# EasyEDA schematic SCH_TDA-Audio-Amplifier_2024-02-14.json
TITLE: TDA2050; REV: 1.0; Date: 2024-01-14; Sheet: 1/1; Drawn By: Vikas Ganesh; Company: Your Company
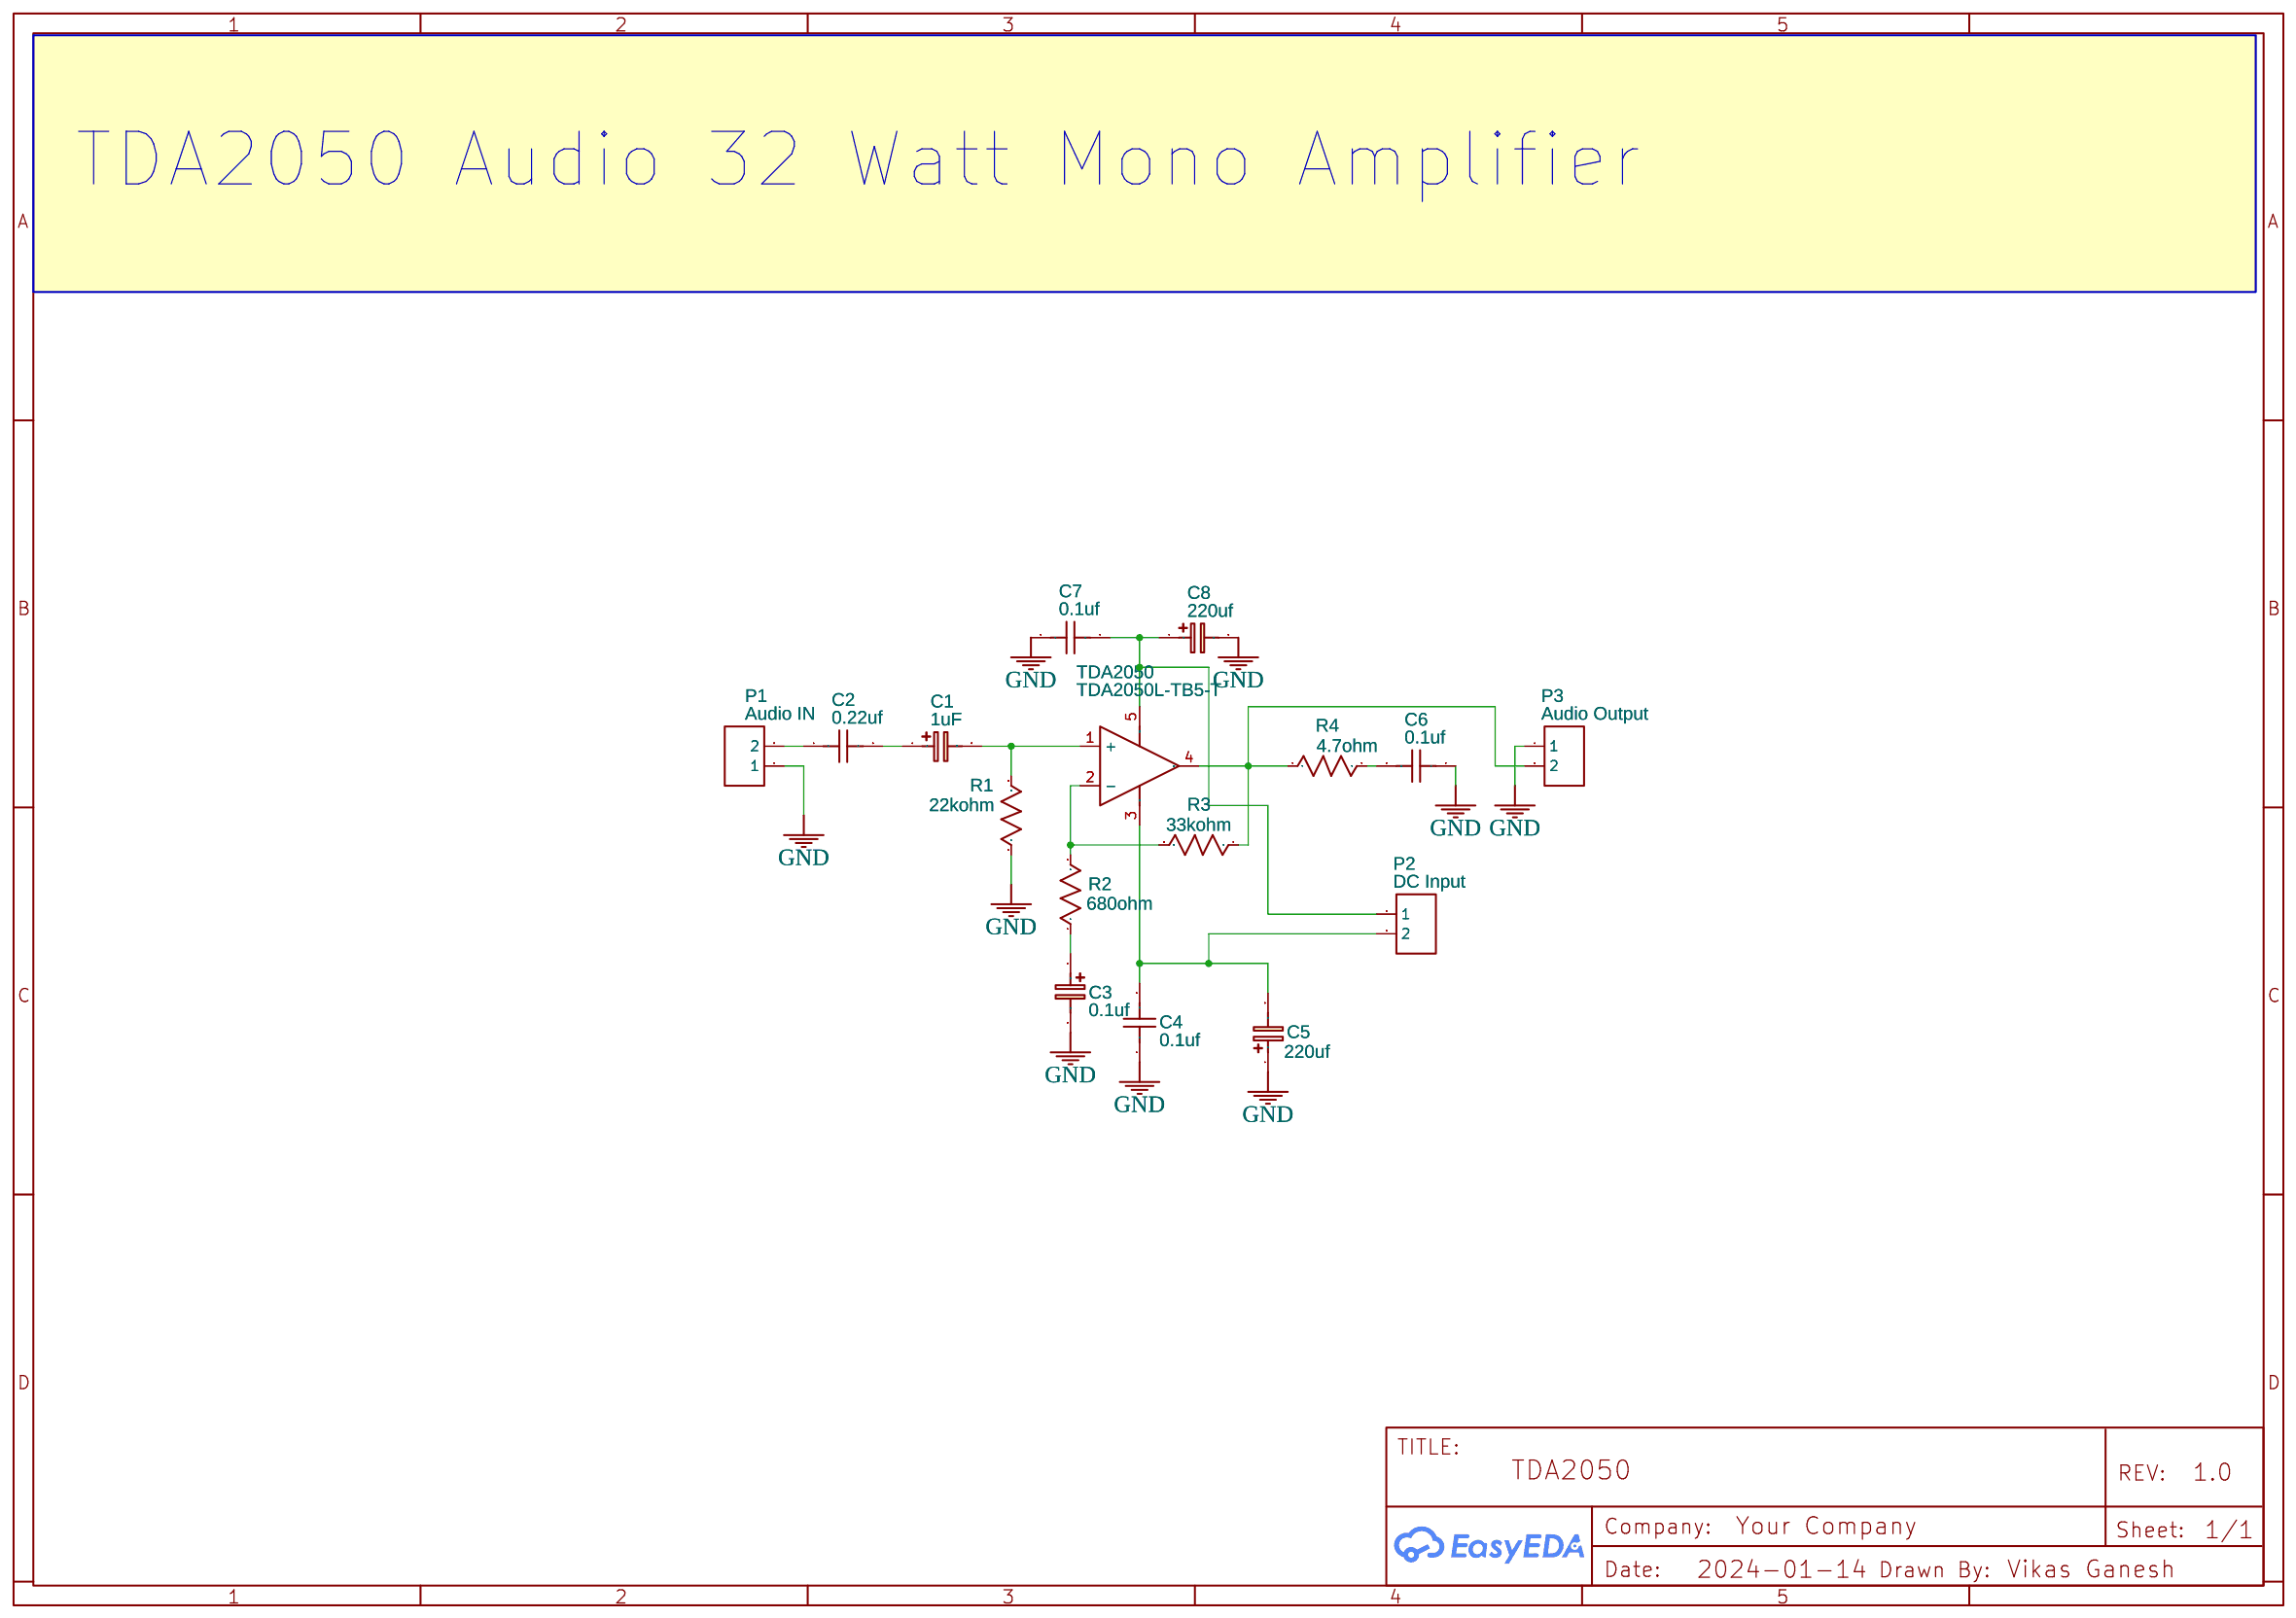
[diagram p0: schematic sheet]

## Parts
C1  1uF  [CAP-D4.0×F1.5]
C2  0.22uf  [RAD-0.1]
C3  0.1uf  [CAP-D4.0×F1.5]
C4  0.1uf  [RAD-0.1]
C5  220uf  [CAP-D4.0×F1.5]
C6  0.1uf  [RAD-0.1]
C7  0.1uf  [RAD-0.1]
C8  220uf  [CAP-D4.0×F1.5]
P1  Audio IN  [CONN-TH_2P-P5.00]
P2  DC Input  [CONN-TH_2P-P5.00]
P3  Audio Output  [CONN-TH_2P-P5.00]
R1  22kohm  [R_AXIAL-0.4]
R2  680ohm  [R_AXIAL-0.4]
R3  33kohm  [R_AXIAL-0.4]
R4  4.7ohm  [R_AXIAL-0.4]
TDA2050  TDA2050L-TB5-T  [TO-220-5_L10.5-W15.5-P1.70-TL]

## Library data of the parts
C1 C3 C5 C8 = CE_TH_D4.0×F1.5_EU: Contributor: LCEDA_Lib
C2 C4 C6 C7 = C_RAD-0.1_US: Contributor: LCEDA_Lib
P1-P3 = CONN-TH_2P-P5.00: Supplier: LCSC; Contributor: LCEDA_Lib
R1-R4 = R_AXIAL-0.4_US: Contributor: LCEDA_Lib
TDA2050 = TDA2050L-TB5-T: Supplier: LCSC; Manufacturer: UTC(友顺); Supplier Part: C84890; JLCPCB Part Class: Extended Part

## Nets
GND: C3.2 C4.1 C5.1 C6.1 C7.2 C8.2 P1.1 P3.1 R1.1
Net-(C1-1): C1.1 C2.2
Net-(C1-2): C1.2 R1.2 TDA2050.1(+)
Net-(C2-1): C2.1 P1.2
Net-(C3-1): C3.1 R2.1
Net-(C4-2): C4.2 C5.2 P2.2 TDA2050.3(GND)
Net-(C6-2): C6.2 R4.2
Net-(C7-1): C7.1 C8.1 P2.1 TDA2050.5(VCC+)
Net-(P3-2): P3.2 R3.1 R4.1 TDA2050.4(OUT)
Net-(R2-2): R2.2 R3.2 TDA2050.2(-)

## Notes on the sheet
- TDA2050 Audio 32 Watt Mono Amplifier
